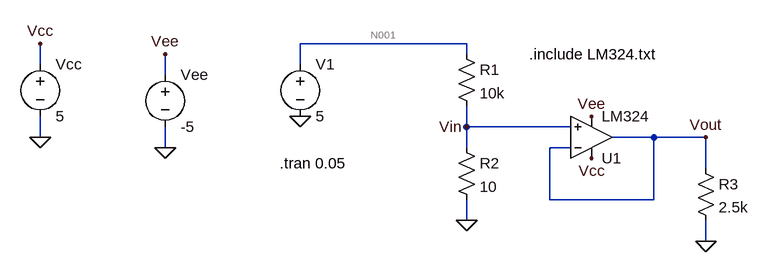
[diagram p0: schematic RhiControl_LM324.asc]
RhiControl_LM324.asc, the LTspice schematic file:
Version 4
SHEET 1 880 680
WIRE -80 80 -336 80
WIRE -80 96 -80 80
WIRE -736 112 -736 80
WIRE -336 112 -336 80
WIRE -544 128 -544 96
WIRE -80 208 -80 176
WIRE 80 208 -80 208
WIRE -736 224 -736 192
WIRE 208 224 144 224
WIRE 288 224 208 224
WIRE -544 240 -544 208
WIRE -80 240 -80 208
WIRE 80 240 48 240
WIRE 288 272 288 224
WIRE 48 320 48 240
WIRE 208 320 208 224
WIRE 208 320 48 320
WIRE -80 352 -80 320
WIRE 288 384 288 352
FLAG -736 80 Vcc
FLAG -736 224 0
FLAG 288 384 0
FLAG -336 192 0
FLAG -80 352 0
FLAG 112 256 Vcc
FLAG -80 208 Vin
FLAG 288 224 Vout
FLAG -544 96 Vee
FLAG -544 240 0
FLAG 112 192 Vee
SYMBOL voltage -736 96 R0
WINDOW 123 0 0 Left 0
WINDOW 39 0 0 Left 0
SYMATTR InstName Vcc
SYMATTR Value 5
SYMBOL res 272 256 R0
SYMATTR InstName R3
SYMATTR Value 2.5k
SYMBOL voltage -336 96 R0
WINDOW 123 0 0 Left 0
WINDOW 39 0 0 Left 0
SYMATTR InstName V1
SYMATTR Value 5
SYMBOL res -96 80 R0
SYMATTR InstName R1
SYMATTR Value 10k
SYMBOL res -96 224 R0
SYMATTR InstName R2
SYMATTR Value 10
SYMBOL voltage -544 112 R0
WINDOW 123 0 0 Left 0
WINDOW 39 0 0 Left 0
SYMATTR InstName Vee
SYMATTR Value -5
SYMBOL OpAmps\\opamp2 112 288 M180
SYMATTR InstName U1
SYMATTR Value LM324
TEXT -368 264 Left 2 !.tran 0.05
TEXT 16 96 Left 2 !.include LM324.txt

The netlist it stands for:
* RhiControl_LM324.asc
Vcc Vcc 0 5
R3 Vout 0 2.5k
V1 N001 0 5
R1 N001 Vin 10k
R2 Vin 0 10
Vee Vee 0 -5
XU1 Vin Vout Vcc Vee Vout LM324  ; pins In+ In- V+ V- OUT
.tran 0.05
.include LM324.txt
.backanno
.end

* Results of the author's LTspice run, read from the files saved beside the schematic
* Operating Point, zero values left out:
*   V(vcc) = 5 V
*   V(vout) = 4.961 mV
*   V(n001) = 5 V
*   V(vin) = 4.995 mV
*   V(vee) = -5 V
*   I(R2) = 499.5 µA
*   I(R1) = 499.5 µA
*   I(R3) = 1.984 µA
*   I(Vee) = 339.9 µA
*   I(V1) = -499.5 µA
*   I(Vcc) = -340 µA
*   Ix(u1:1) = -19.93 nA
*   Ix(u1:2) = -19.94 nA
*   Ix(u1:3) = 340 µA
*   Ix(u1:4) = -339.9 µA
*   Ix(u1:5) = -1.965 µA